# EAGLE design board (EAGLE 5.06)
TITLE: GPS Radio
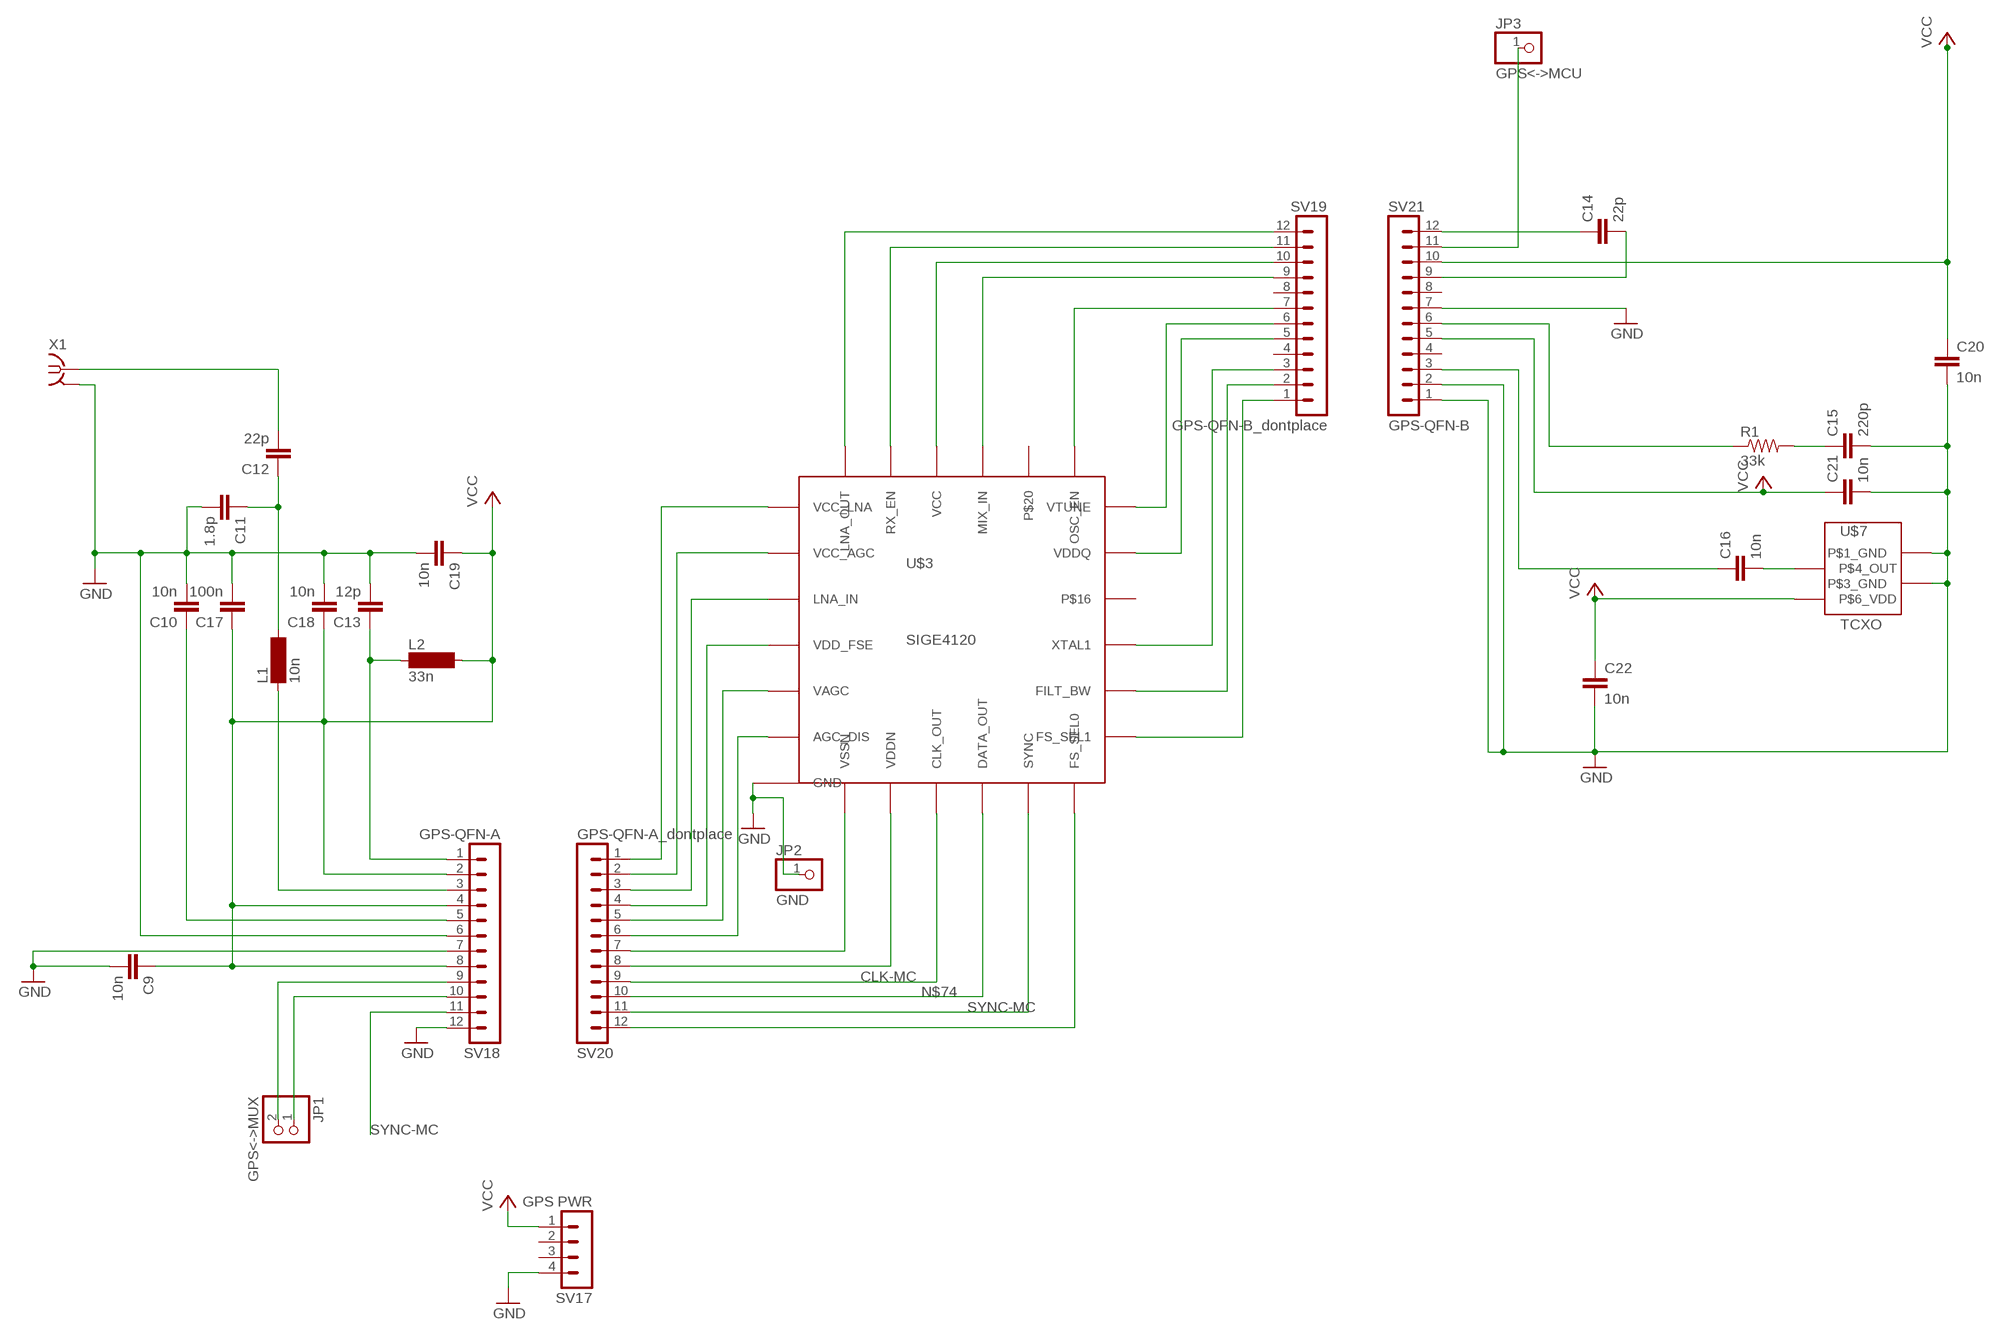
[diagram p0: schematic, sheet 1]

## Parts
C9  10n  CAPPTH  [CAP-PTH-SMALL]
C10  10n  CAPPTH  [CAP-PTH-SMALL]
C11  1.8p  CAPPTH  [CAP-PTH-SMALL]
C12  22p  CAPPTH  [CAP-PTH-SMALL]
C13  12p  CAPPTH  [CAP-PTH-SMALL]
C14  22p  CAPPTH  [CAP-PTH-SMALL]
C15  220p  CAPPTH  [CAP-PTH-SMALL]
C16  10n  CAPPTH  [CAP-PTH-SMALL]
C17  100n  CAPPTH  [CAP-PTH-SMALL]
C18  10n  CAPPTH  [CAP-PTH-SMALL]
C19  10n  CAPPTH  [CAP-PTH-SMALL]
C20  10n  CAPPTH  [CAP-PTH-SMALL]
C21  10n  CAPPTH  [CAP-PTH-SMALL]
C22  10n  CAPPTH  [CAP-PTH-SMALL]
JP1  GPS<->MUX  PINHD-1X2  [1X02]
JP2  GND  PINHD-1X1  [1X01]
JP3  GPS<->MCU  PINHD-1X1  [1X01]
L1  10n  SM-NE29  [SM-NE29]
L2  33n  MS50  [MS50]
R1  33k  RESISTORPTH1  [AXIAL-0.3]
SV17  GPS PWR  MA04-1  [MA04-1]
SV18  GPS-QFN-A  MA12-1  [MA12-1]
SV19  GPS-QFN-B_dontplace  MA12-1  [MA12-1]
SV20  GPS-QFN-A_dontplace  MA12-1  [MA12-1]
SV21  GPS-QFN-B  MA12-1  [MA12-1]
U$3  SIGE4120  [SIGE4120]
U$7  TCXO  [TXCO]
X1  BU-SMA-G  [BU-SMA-G]

## Nets
CLK-MC: SV20.9 U$3.CLK_OUT
GND: C9.2 C10.2 C11.2 C13.2 C15.2 C17.2 C18.2 C19.2 C20.2 C21.2 C22.2 JP2.1 SV17.4 SV18.6 SV18.7 SV18.12 SV21.1 SV21.2 SV21.7 U$3.GND U$7.P$1_GND U$7.P$3_GND X1.2(GND)
N$5: C10.1 SV18.5
N$7: SV20.3 U$3.LNA_IN
N$8: C11.1 C12.1 L1.2
N$9: C12.2 X1.1
N$10: SV20.1 U$3.VCC_LNA
N$11: SV19.12 U$3.LNA_OUT
N$12: C14.2 SV21.9
N$13: SV19.6 U$3.VTUNE
N$14: C15.1 R1.P$2
N$15: SV19.3 U$3.XTAL1
N$40: C16.2 U$7.P$4_OUTPUT(P$4_OUT)
N$42: L1.1 SV18.3
N$45: C14.1 SV21.12
N$50: C13.1 L2.1 SV18.1
N$51: SV20.2 U$3.VCC_AGC
N$55: SV20.4 U$3.VDD_FSE
N$56: SV20.5 U$3.VAGC
N$57: SV20.6 U$3.AGC_DIS
N$58: SV20.7 U$3.VSSN
N$59: SV20.8 U$3.VDDN
N$60: JP1.2 SV18.9
N$61: JP1.1 SV18.10
N$62: JP3.1 SV21.11
N$63: SV20.12 U$3.FS_SEL0
N$64: SV19.10 U$3.VCC
N$65: SV19.9 U$3.MIX_IN
N$66: SV19.7 U$3.OSC_EN
N$67: SV19.5 U$3.VDDQ
N$68: R1.P$1 SV21.6
N$69: C16.1 SV21.3
N$70: SV19.2 U$3.FILT_BW
N$71: SV19.1 U$3.FS_SEL1
N$74: SV20.10 U$3.DATA_OUT
RX_EN: SV19.11 U$3.RX_EN
SYNC-MC: SV18.11 SV20.11 U$3.SYNC
VCC: C9.1 C17.1 C18.1 C19.1 C20.1 C21.1 C22.1 L2.2 SV17.1 SV18.2 SV18.4 SV18.8 SV21.5 SV21.10 U$7.P$6_VDD
Unconnected: SV17.2 SV17.3 SV19.4 SV19.8 SV21.4 SV21.8 U$3.P$16 U$3.P$20

## Power pins joined to a net without a drawn wire
GND: X1.3(GND) X1.4(GND) X1.5(GND)

## Library data of the parts
C9-C22 = SparkFun:CAP: Capacitor Standard 0603 ceramic capacitor, and 0.1" leaded capacitor.
JP1 = pinhead:PINHD-1X2: PIN HEADER
JP2 JP3 = pinhead:PINHD-1X1: PIN HEADER
L1 = inductor-neosid:SM-NE29: INDUCTOR SMD chip inductor
L2 = inductor-neosid:MS50: INDUCTOR SMD power inductor
R1 = SparkFun:RESISTOR: Resistor Basic schematic elements and footprints for 0603, 1206, and PTH 1/10th watt (small) resistors.
SV17 = con-lstb:MA04-1: PIN HEADER
SV18-SV21 = con-lstb:MA12-1: PIN HEADER
U$3 = mylib:SIGE4120
U$7 = mylib:TCXO
X1 = con-coax:BU-SMA-G: FEMALE SMA CONNECTOR Radiall distributor RS 193-9117

## Board
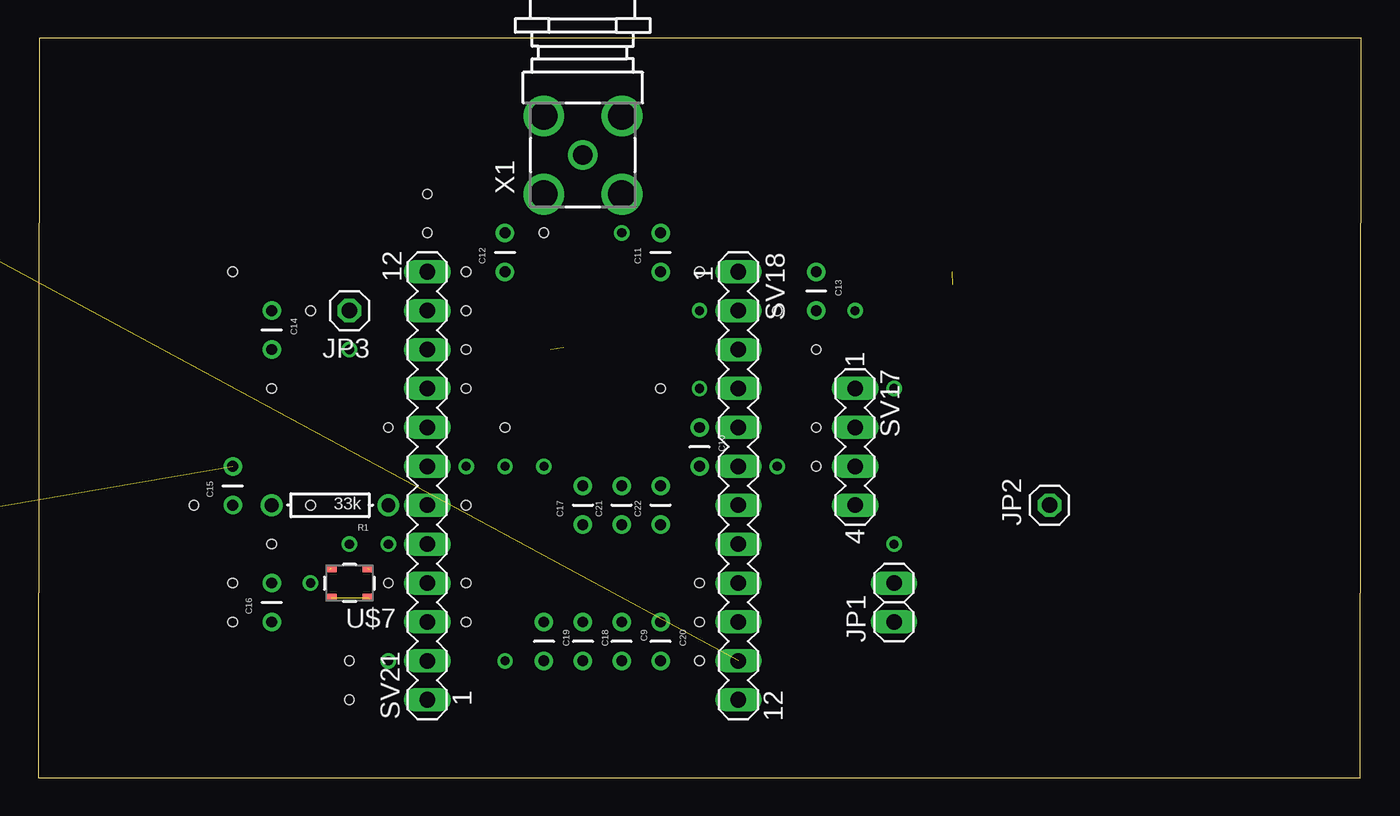
[diagram p1: board, top side]
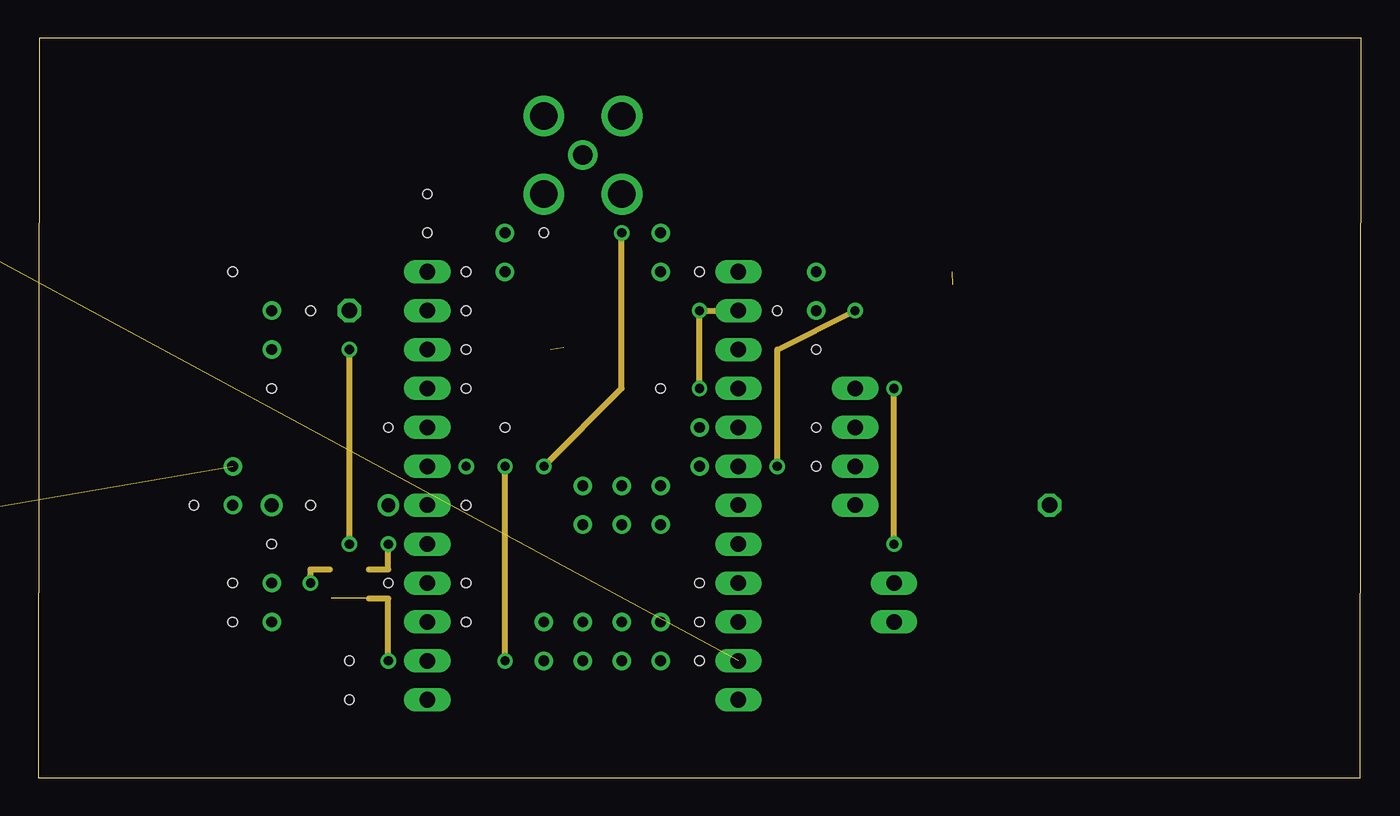
[diagram p2: board, inner layer Route15]
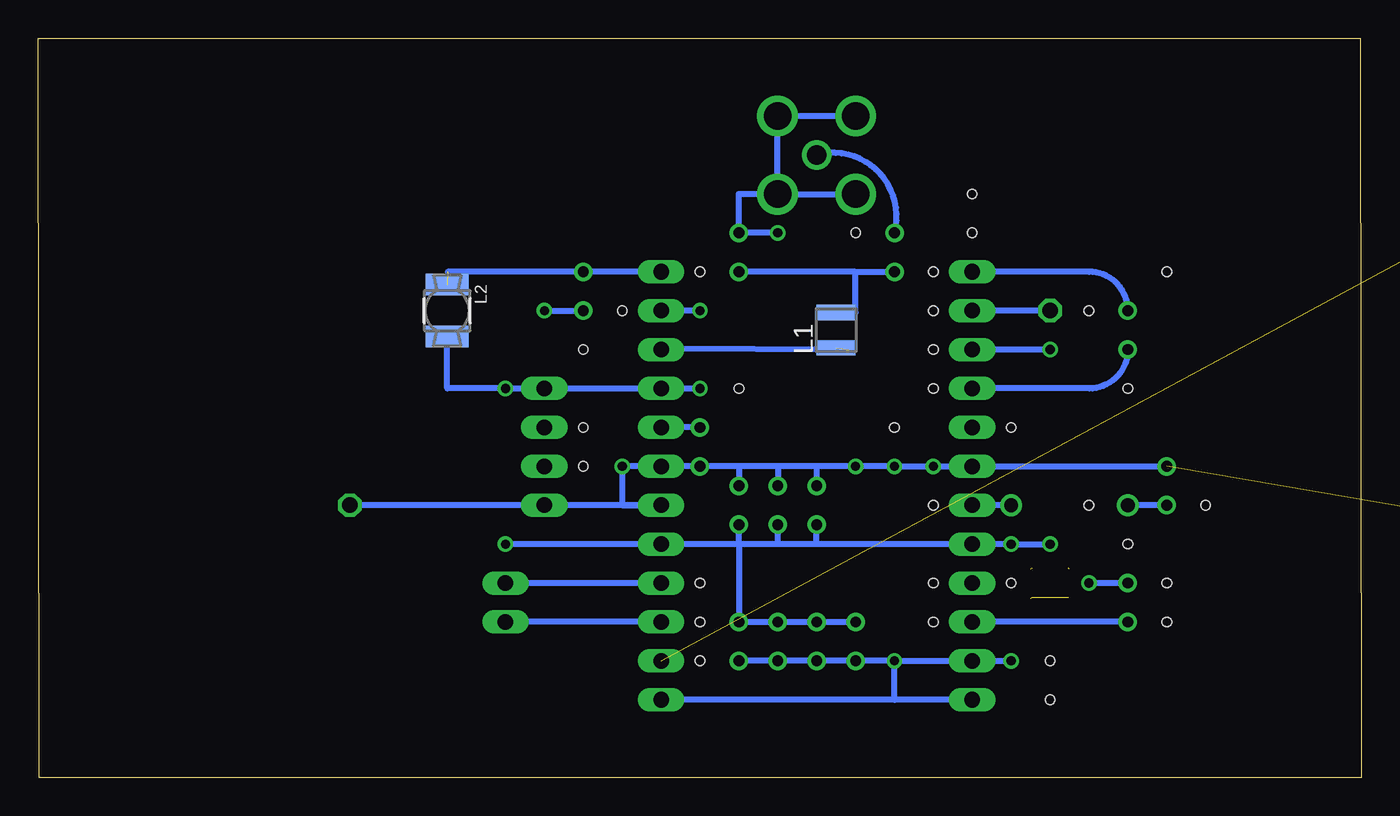
[diagram p3: board, bottom side, seen from below]

Size 86.39 x 48.26 mm. Coordinates in mm from the lower left corner, seen from the top.
Outline: 0,0 86.34,0 86.39,48.26 0.05,48.26 0,0
Copper layers (1*16): Top 0.035mm / dielectric 1.5mm / Bottom 0.035mm
Design rules "default *": minimum track width 10mil, minimum drill 24mil, track to track 2mil, track to pad 2mil, pad to pad 2mil, via to via 2mil, smd to smd 2mil, copper to edge 2mil, drill to drill 2mil, minimum pad ring 10mil, minimum via ring 8mil, stop-mask expansion 4mil, vias tented up to drill 0mil, thermal gap 10mil
Holes 0.6 mm at 17.78,30.48 15.24,25.4 27.94,30.48 50.8,22.86 12.7,10.16 12.7,12.7 22.86,12.7 43.18,33.02 50.8,27.94 40.64,25.4 22.86,22.86 27.94,33.02 27.94,27.94 27.94,25.4 30.48,22.86 27.94,17.78 27.94,12.7 27.94,10.16 43.18,7.62 43.18,10.16 43.18,12.7 50.8,20.32 20.32,7.62 20.32,5.08 15.24,15.24 10.16,17.78 17.78,17.78 25.4,35.56 25.4,38.1 12.7,33.02 48.26,30.48 33.02,35.56

### Footprints (pad centres in the part's own frame; a part is rotated, then mirrored left to right if it is on the bottom)
CAP-PTH-SMALL = drill 0.7 round: 1 0,0; 2 2.54,0
1X02 = drill 1.016 long: 1 -1.27,0; 2 1.27,0
1X01 = drill 1.016 octagon: 1 0,0
SM-NE29 = smd 1 x 2.54: 1 -1.15,0; 2 1.15,0
MS50 = smd 2.8 x 1.4: 1 0,-1.7; 2 0,1.7
AXIAL-0.3 = drill 0.9 round: P$1 -3.81,0; P$2 3.81,0
MA04-1 = drill 1.016 long: 1 -3.81,0; 2 -1.27,0; 3 1.27,0; 4 3.81,0
MA12-1 = drill 1.016 long: 1 -13.97,0; 2 -11.43,0; 3 -8.89,0; 4 -6.35,0; 5 -3.81,0; 6 -1.27,0; 7 1.27,0; 8 3.81,0; 9 6.35,0; 10 8.89,0; 11 11.43,0; 12 13.97,0
SIGE4120 = smd 0.5 x 0.25: AGC_DIS -1.85,-1.25; FILT_BW 1.85,-0.75; FS_SEL1 1.85,-1.25; LNA_IN -1.85,0.25; P$16 1.85,0.25; VAGC -1.85,-0.75; VCC_AGC -1.85,0.75; VCC_LNA -1.85,1.25; VDD_FSE -1.85,-0.25; VDDQ 1.85,0.75; VTUNE 1.85,1.25; XTAL1 1.85,-0.25 | smd 0.25 x 0.5: CLK_OUT -0.25,-1.85; DATA_OUT 0.25,-1.85; FS_SEL0 1.25,-1.85; LNA_OUT -1.25,1.85; MIX_IN 0.25,1.85; OSC_EN 1.25,1.85; P$20 0.75,1.85; RX_EN -0.75,1.85; SYNC 0.75,-1.85; VCC -0.25,1.85; VDDN -0.75,-1.85; VSSN -1.25,-1.85 | smd 2.3 x 2.3: GND 0,0
TXCO = smd 0.7 x 0.5: P$1_GND -1.2,0.95; P$3_GND 1.2,0.95; P$4_OUTPUT 1.2,-0.95; P$6_VDD -1.2,-0.95
BU-SMA-G = drill 1.27 round: 1 0,0 | drill 1.778 round: 2 -2.55,2.55; 3 2.55,2.55; 4 2.55,-2.55; 5 -2.55,-2.55

### Placement (x,y rotation side)
C9  38.1,10.16 270 top
C10  43.18,22.86 270 top
C11  40.64,33.02 90 top
C12  30.48,33.02 90 top
C13  50.8,33.02 270 top
C14  15.24,30.48 270 top
C15  12.7,17.78 90 top
C16  15.24,10.16 90 top
C17  35.56,16.51 90 top
C18  35.56,10.16 270 top
C19  33.02,10.16 270 top
C20  40.64,10.16 270 top
C21  38.1,16.51 90 top
C22  40.64,16.51 90 top
JP1  55.88,11.43 90 top
JP2  66.04,17.78 90 top
JP3  20.32,30.48 180 top
L1  34.29,29.21 90 bottom
L2  59.69,30.48 180 bottom
R1  19.05,17.78 180 top
SV17  53.34,21.59 270 top
SV18  45.72,19.05 270 top
SV19  -62.23,34.29 0 top  (outside the outline)
SV20  -29.21,41.91 0 top  (outside the outline)
SV21  25.4,19.05 90 top
U$3  -76.2,5.08 0 top  (outside the outline)
U$7  20.32,12.7 180 top
X1  35.56,40.64 90 top

### Tracks (layer width: path | path; a pad name or v marks a point on that pad's centre or on a via)
CLK-MC  (1 unrouted)
GND  (via drill 0.6)  (3 unrouted)
  Route15 0.406: 21.59,11.68 22.86,11.68 v22.86,7.62 | v30.48,7.62 v30.48,20.32 | v48.26,20.32 48.26,27.94 v53.34,30.48 | v38.1,35.56 38.1,25.4 v33.02,20.32
  Bottom 0.406: v27.94,20.32 C15.2 | C10.2 SV18.6 C10.2 | 40.64,20.32 v48.26,20.32 48.26,17.78 SV18.7 SV17.4 JP2.1 | v30.48,7.62 SV21.2 | v30.48,7.62 v22.86,7.62 | v30.48,7.62 v22.86,7.62 | v30.48,7.62 v22.86,7.62 | v30.48,7.62 v22.86,7.62 | v30.48,7.62 v22.86,7.62 | v30.48,7.62 v22.86,7.62 | v30.48,7.62 v22.86,7.62 | v30.48,7.62 v22.86,7.62 | 40.64,20.32 C10.2 | 35.56,20.32 38.1,20.32 | 38.1,20.32 40.64,20.32 | 30.48,5.08 SV18.12 | 30.48,5.08 v30.48,7.62 | SV21.1 30.48,5.08 | 40.64,20.32 C22.2 | v53.34,30.48 C13.2 | v30.48,7.62 C19.2 | C19.2 C18.2 | C18.2 C9.2 | C9.2 C20.2 C9.2 | C19.2 C18.2 | v27.94,20.32 v30.48,20.32 v33.02,20.32 35.56,20.32 | v27.94,20.32 SV21.7 | 38.1,20.32 C21.2 | 35.56,20.32 C17.2 | X1.5 | X1.5 40.64,38.1 C11.2 v38.1,35.56 | X1.5 X1.2 | X1.3 X1.4 X1.5
N$5
  Bottom 0.406: C10.1 SV18.5
N$7  (1 unrouted)
N$8
  Bottom 0.406: 33.02,33.02 C12.1 | 33.02,33.02 C11.1 | L1.2 33.02,30.36 33.02,33.02
N$9
  Bottom 0.406: C12.2 arc-120 X1.1
N$10  (1 unrouted)
N$11  (1 unrouted)
N$12
  Bottom 0.406: C14.2 arc90 17.78,25.4 SV21.9
N$13  (1 unrouted)
N$14
  Bottom 0.406: C15.1 R1.P$2
N$15  (1 unrouted)
N$40  (via drill 0.6)  (1 unrouted)
  Route15 0.406: 19.05,13.59 17.78,13.59 v17.78,12.7
  Bottom 0.406: C16.2 v17.78,12.7
N$42  (1 unrouted)
  Bottom 0.406: 33.45,27.94 45.68,27.98 arc-90 SV18.3
N$45
  Bottom 0.406: C14.1 arc-90 17.78,33.02 SV21.12
N$50  (1 unrouted)
  Bottom 0.406: SV18.1 C13.1 59.65,33.02
N$51  (1 unrouted)
N$55  (1 unrouted)
N$56  (1 unrouted)
N$57  (1 unrouted)
N$58  (1 unrouted)
N$59  (1 unrouted)
N$60
  Bottom 0.406: SV18.9 JP1.2
N$61
  Bottom 0.406: SV18.10 JP1.1
N$62
  Bottom 0.406: JP3.1 SV21.11
N$63  (1 unrouted)
N$64  (1 unrouted)
N$65  (1 unrouted)
N$66  (1 unrouted)
N$67  (1 unrouted)
N$68
  Bottom 0.406: R1.P$1 SV21.6
N$69
  Bottom 0.406: C16.1 SV21.3
N$70  (1 unrouted)
N$71  (1 unrouted)
N$74  (1 unrouted)
RX_EN  (1 unrouted)
SYNC-MC  (2 unrouted)
VCC  (via drill 0.6)  (1 unrouted)
  Route15 0.406: v55.88,15.24 v55.88,25.4 | 21.59,13.59 22.86,13.59 v22.86,15.24 | v20.32,15.24 v20.32,27.94 | SV18.2 v43.18,30.48 v43.18,25.4
  Bottom 0.406: v22.86,15.24 v20.32,15.24 | v22.86,15.24 SV21.5 | v22.86,15.24 v20.32,15.24 | v22.86,15.24 v20.32,15.24 | v22.86,15.24 v20.32,15.24 | v22.86,15.24 SV21.5 | v22.86,15.24 v20.32,15.24 | v22.86,15.24 v20.32,15.24 | v22.86,15.24 v20.32,15.24 | v22.86,15.24 SV21.5 | v22.86,15.24 v20.32,15.24 | v22.86,15.24 v20.32,15.24 | v22.86,15.24 v20.32,15.24 | v22.86,15.24 SV21.5 | v22.86,15.24 v20.32,15.24 | v22.86,15.24 v20.32,15.24 | v22.86,15.24 v20.32,15.24 | v22.86,15.24 SV21.5 | v22.86,15.24 v20.32,15.24 | v22.86,15.24 v20.32,15.24 | v22.86,15.24 v20.32,15.24 | v22.86,15.24 SV21.5 | v22.86,15.24 v20.32,15.24 | v22.86,15.24 v20.32,15.24 | 40.64,15.24 SV18.8 | v22.86,15.24 35.56,15.24 | 35.56,15.24 38.1,15.24 | 38.1,15.24 40.64,15.24 | 40.64,15.24 v55.88,15.24 | v22.86,15.24 v20.32,15.24 | v22.86,15.24 SV21.5 | v20.32,27.94 SV21.10 | 40.64,15.24 55.24,15.24 | 40.64,15.24 C22.1 | v43.18,30.48 SV18.2 | C20.1 C9.1 | C9.1 C18.1 | C18.1 C19.1 | 40.64,15.24 C20.1 | C9.1 C18.1 | C20.1 C9.1 | C20.1 C9.1 | 38.1,15.24 C21.1 | 35.56,15.24 C17.1 | L2.2 59.69,25.4 v55.88,25.4 SV17.1 SV18.4 v43.18,25.4